# EAGLE design EW Driver (EAGLE 7.5.0)

## Sheet 1 of 2
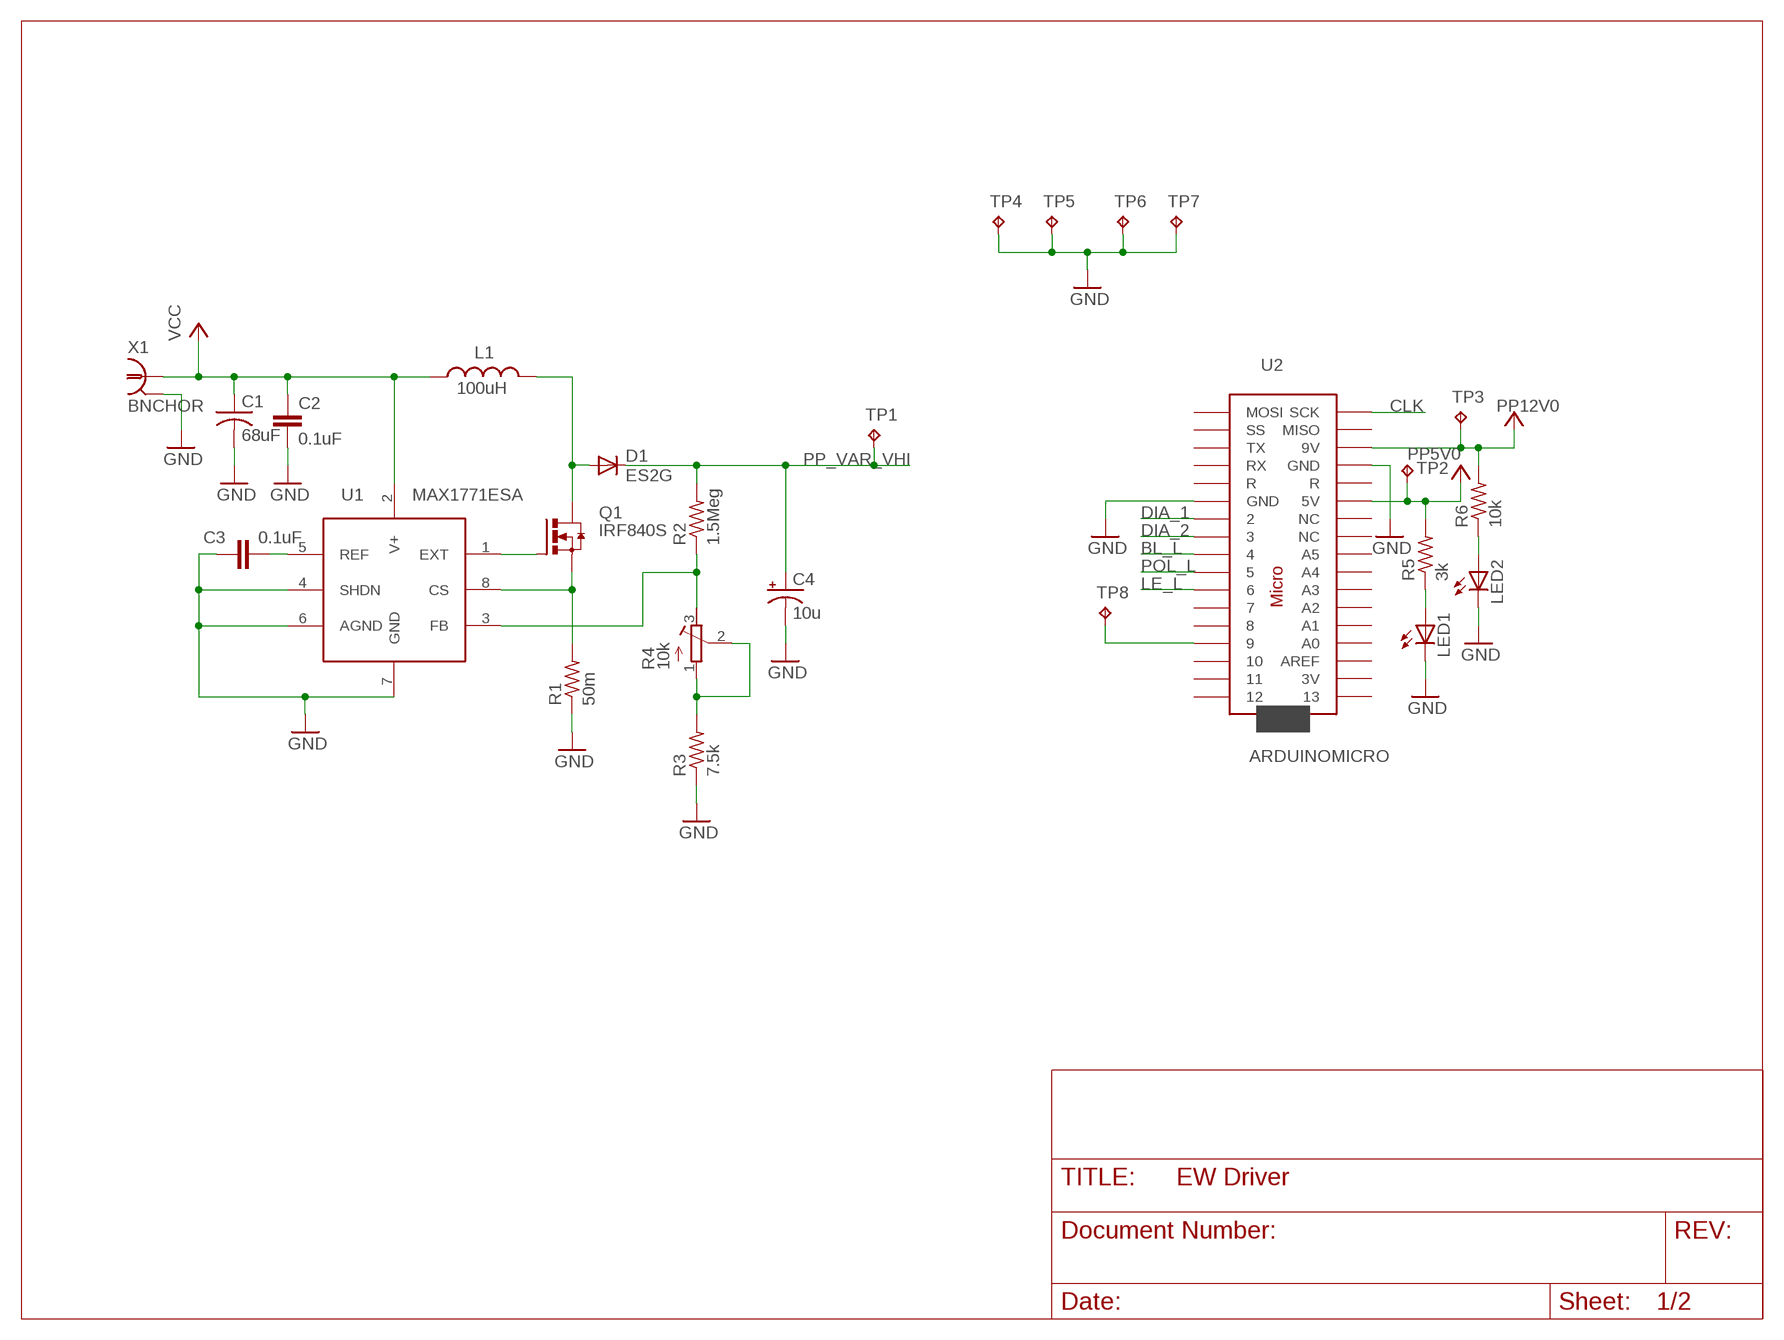
[diagram p0: schematic, sheet 1]

### Parts
C1  68uF  CC2312  [C2312]
C2  0.1uF  CC1206  [C1206]
C3  0.1uF  CC1206  [C1206]
C4  10u  10UF-350V-20%(ELECT)  [PANASONIC_D]
D1  ES2G  DIODE-DO214AA  [DO214AA]
L1  100uH  TDK_IND  [P0762NL]
LED1  LED_ESML0603  [LED_SML0603]
LED2  LED_ESML0603  [LED_SML0603]
Q1  IRF840S  [D2PACK]
R1  50m  R-US_R1206  [R1206]
R2  1.5Meg  R-US_R1206  [R1206]
R3  7.5k  R-US_R0805  [R0805]
R4  10k  R-TRIMM3296P  [RTRIM3296P]
R5  3k  R-US_R0805  [R0805]
R6  10k  R-US_R0805  [R0805]
TP1  TP  [TEST_SMT]
TP2  TP  [TEST_SMT]
TP3  TP  [TEST_SMT]
TP4  TP063  [TEST_TH]
TP5  TP063  [TEST_TH]
TP6  TP063  [TEST_TH]
TP7  TP063  [TEST_TH]
TP8  TP  [TEST_SMT]
U1  MAX1771ESA  [SO08]
U2  ARDUINOMICRO  [ARDUINOMICRO]
X1  BNCHOR  [BNC_HOR]

### Nets
BL_L: U2.P$9 ; also sheet 2
CLK: U2.P$18(SCK) ; also sheet 2
DIA_1: U2.P$11 ; also sheet 2
DIA_2: U2.P$10 ; also sheet 2
GND: C1.2 C2.2 C3.2 C4.- LED1.C LED2.C R1.1 R3.1 TP4.TP TP5.TP TP6.TP TP7.TP U1.4(SHDN) U1.6(AGND) U1.7(GND) U2.P$12(GND) U2.P$21(GND) X1.2 X1.3 ; also sheet 2
LE_L: U2.P$7 ; also sheet 2
N$1: C3.1 U1.5(REF)
N$2: Q1.1(G) U1.1(EXT)
N$3: Q1.3(S) R1.2 U1.8(CS)
N$4: D1.A L1.2 Q1.2(D)
N$5: R3.2 R4.1(A) R4.2(S)
N$6: R2.1 R4.3(E) U1.3(FB)
N$10: LED1.A R5.1
N$11: LED2.A R6.1
N$12: TP8.TP U2.P$4
POL_L: U2.P$8 ; also sheet 2
PP5V0: R5.2 TP2.TP U2.P$23(5V) ; also sheet 2
PP12V0: C1.1 C2.1 L1.1 R6.2 TP3.TP U1.2(V+) U2.P$20(9V) X1.1 ; supply symbol labelled VCC
PP_VAR_VHI: C4.+ D1.C R2.2 TP1.TP ; also sheet 2
Unconnected: U2.P$1 U2.P$2 U2.P$3 U2.P$5 U2.P$6 U2.P$13(R) U2.P$14(RX) U2.P$15(TX) U2.P$16(SS) U2.P$17(MOSI) U2.P$19(MISO) U2.P$22(R) U2.P$24(NC) U2.P$25(NC) U2.P$26(A5) U2.P$27(A4) U2.P$28(A3) U2.P$29(A2) U2.P$30(A1) U2.P$31(A0) U2.P$32(AREF) U2.P$33(3V) U2.P$34

## Sheet 2 of 2
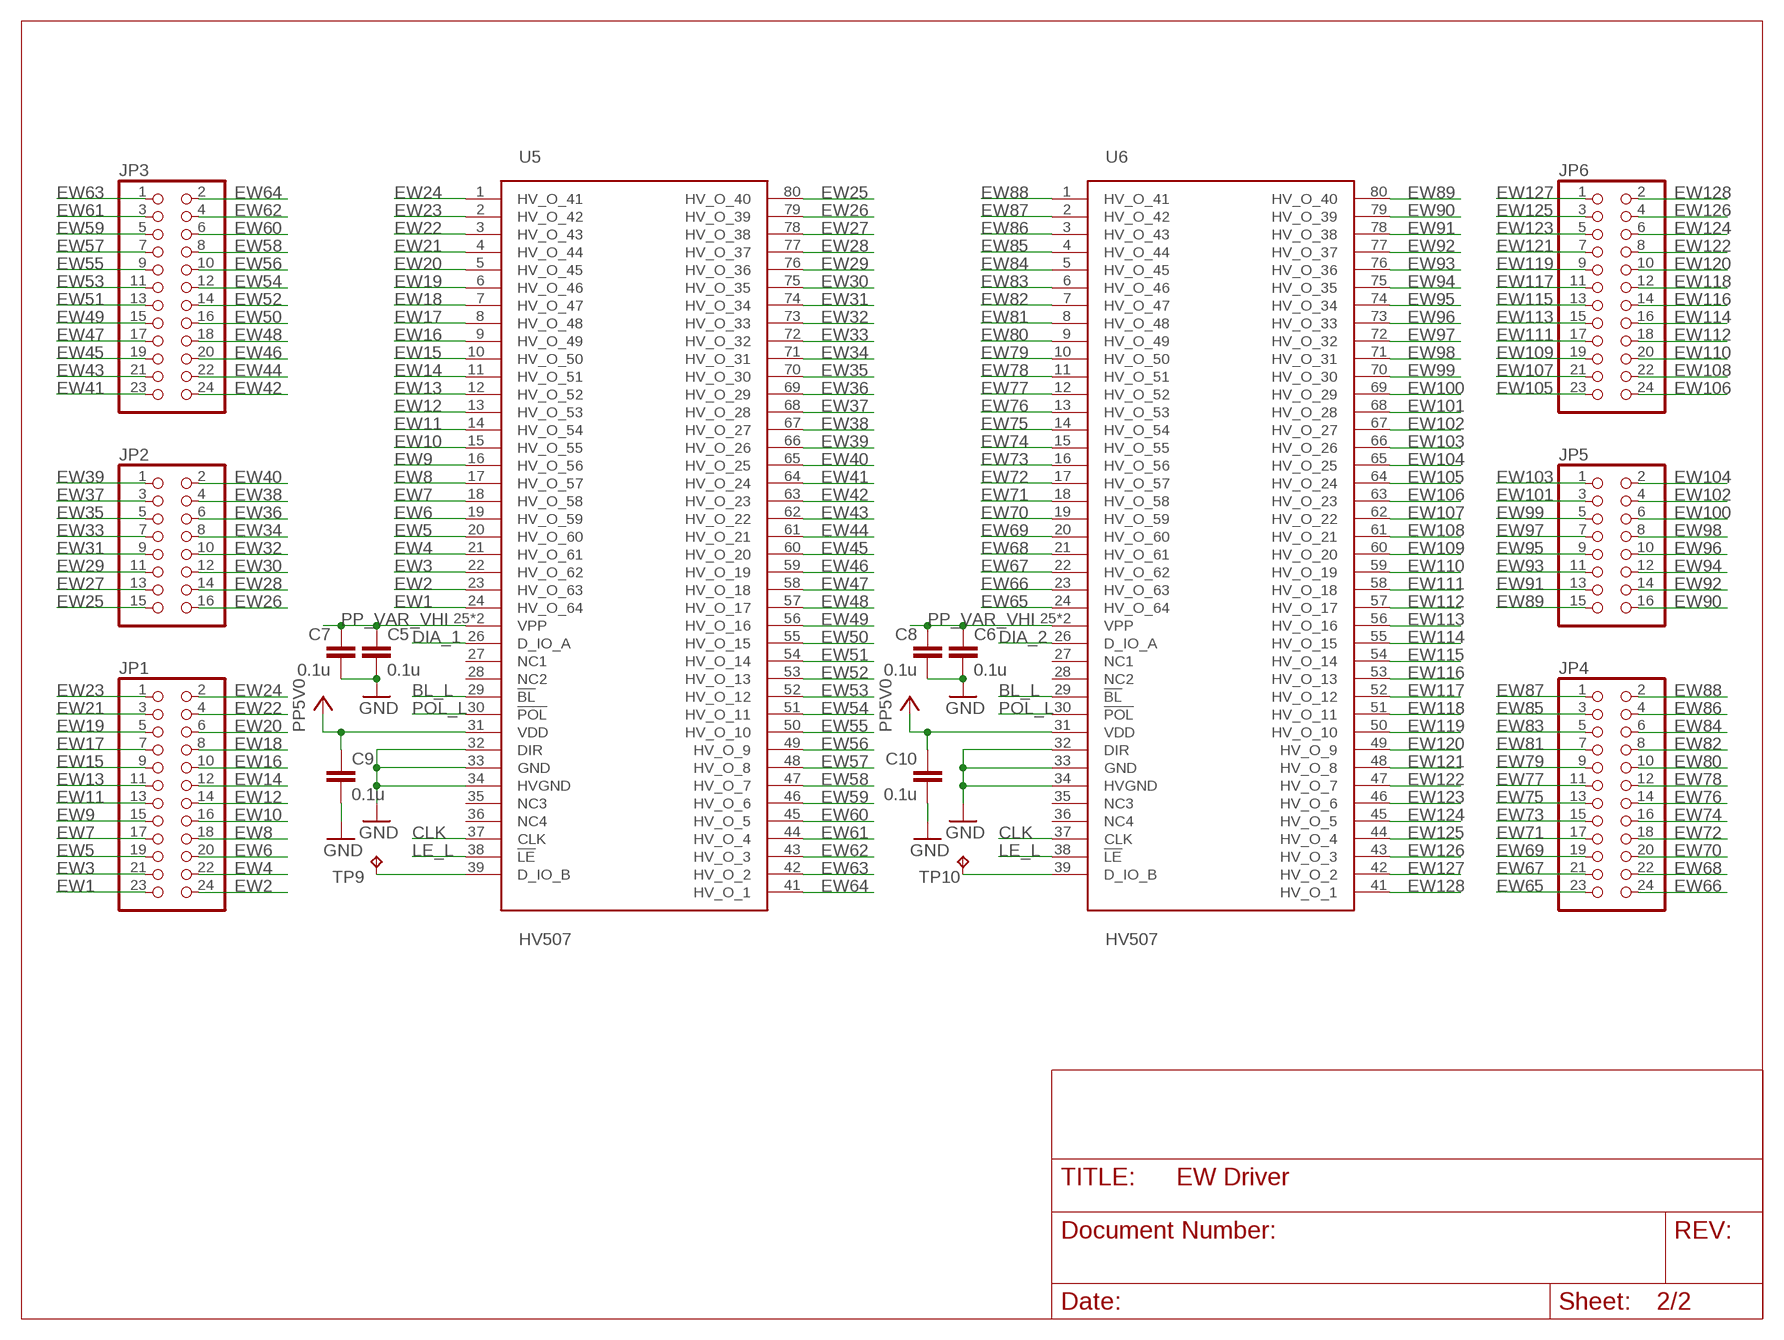
[diagram p1: schematic, sheet 2]

### Parts
C5  0.1u  CC1206  [C1206]
C6  0.1u  CC1206  [C1206]
C7  0.1u  CC1206  [C1206]
C8  0.1u  CC1206  [C1206]
C9  0.1u  CC1206  [C1206]
C10  0.1u  CC1206  [C1206]
JP1  PINHD-2X12_0.05  [2X12_0.05]
JP2  PINHD-2X8_0.05  [2X8_0.05]
JP3  PINHD-2X12_0.05  [2X12_0.05]
JP4  PINHD-2X12_0.05  [2X12_0.05]
JP5  PINHD-2X8_0.05  [2X8_0.05]
JP6  PINHD-2X12_0.05  [2X12_0.05]
TP9  TP  [TEST_SMT]
TP10  TP  [TEST_SMT]
U5  HV507  [HV507PG-G]
U6  HV507  [HV507PG-G]

### Nets
BL_L: U5.29(!BL) U6.29(!BL) ; also sheet 1
CLK: U5.37(CLK) U6.37(CLK) ; also sheet 1
DIA_1: U5.26(D_IO_A) ; also sheet 1
DIA_2: U6.26(D_IO_A) ; also sheet 1
EW1: JP1.23 U5.24(HV_O_64)
EW2: JP1.24 U5.23(HV_O_63)
EW3: JP1.21 U5.22(HV_O_62)
EW4: JP1.22 U5.21(HV_O_61)
EW5: JP1.19 U5.20(HV_O_60)
EW6: JP1.20 U5.19(HV_O_59)
EW7: JP1.17 U5.18(HV_O_58)
EW8: JP1.18 U5.17(HV_O_57)
EW9: JP1.15 U5.16(HV_O_56)
EW10: JP1.16 U5.15(HV_O_55)
EW11: JP1.13 U5.14(HV_O_54)
EW12: JP1.14 U5.13(HV_O_53)
EW13: JP1.11 U5.12(HV_O_52)
EW14: JP1.12 U5.11(HV_O_51)
EW15: JP1.9 U5.10(HV_O_50)
EW16: JP1.10 U5.9(HV_O_49)
EW17: JP1.7 U5.8(HV_O_48)
EW18: JP1.8 U5.7(HV_O_47)
EW19: JP1.5 U5.6(HV_O_46)
EW20: JP1.6 U5.5(HV_O_45)
EW21: JP1.3 U5.4(HV_O_44)
EW22: JP1.4 U5.3(HV_O_43)
EW23: JP1.1 U5.2(HV_O_42)
EW24: JP1.2 U5.1(HV_O_41)
EW25: JP2.15 U5.80(HV_O_40)
EW26: JP2.16 U5.79(HV_O_39)
EW27: JP2.13 U5.78(HV_O_38)
EW28: JP2.14 U5.77(HV_O_37)
EW29: JP2.11 U5.76(HV_O_36)
EW30: JP2.12 U5.75(HV_O_35)
EW31: JP2.9 U5.74(HV_O_34)
EW32: JP2.10 U5.73(HV_O_33)
EW33: JP2.7 U5.72(HV_O_32)
EW34: JP2.8 U5.71(HV_O_31)
EW35: JP2.5 U5.70(HV_O_30)
EW36: JP2.6 U5.69(HV_O_29)
EW37: JP2.3 U5.68(HV_O_28)
EW38: JP2.4 U5.67(HV_O_27)
EW39: JP2.1 U5.66(HV_O_26)
EW40: JP2.2 U5.65(HV_O_25)
EW41: JP3.23 U5.64(HV_O_24)
EW42: JP3.24 U5.63(HV_O_23)
EW43: JP3.21 U5.62(HV_O_22)
EW44: JP3.22 U5.61(HV_O_21)
EW45: JP3.19 U5.60(HV_O_20)
EW46: JP3.20 U5.59(HV_O_19)
EW47: JP3.17 U5.58(HV_O_18)
EW48: JP3.18 U5.57(HV_O_17)
EW49: JP3.15 U5.56(HV_O_16)
EW50: JP3.16 U5.55(HV_O_15)
EW51: JP3.13 U5.54(HV_O_14)
EW52: JP3.14 U5.53(HV_O_13)
EW53: JP3.11 U5.52(HV_O_12)
EW54: JP3.12 U5.51(HV_O_11)
EW55: JP3.9 U5.50(HV_O_10)
EW56: JP3.10 U5.49(HV_O_9)
EW57: JP3.7 U5.48(HV_O_8)
EW58: JP3.8 U5.47(HV_O_7)
EW59: JP3.5 U5.46(HV_O_6)
EW60: JP3.6 U5.45(HV_O_5)
EW61: JP3.3 U5.44(HV_O_4)
EW62: JP3.4 U5.43(HV_O_3)
EW63: JP3.1 U5.42(HV_O_2)
EW64: JP3.2 U5.41(HV_O_1)
EW65: JP4.23 U6.24(HV_O_64)
EW66: JP4.24 U6.23(HV_O_63)
EW67: JP4.21 U6.22(HV_O_62)
EW68: JP4.22 U6.21(HV_O_61)
EW69: JP4.19 U6.20(HV_O_60)
EW70: JP4.20 U6.19(HV_O_59)
EW71: JP4.17 U6.18(HV_O_58)
EW72: JP4.18 U6.17(HV_O_57)
EW73: JP4.15 U6.16(HV_O_56)
EW74: JP4.16 U6.15(HV_O_55)
EW75: JP4.13 U6.14(HV_O_54)
EW76: JP4.14 U6.13(HV_O_53)
EW77: JP4.11 U6.12(HV_O_52)
EW78: JP4.12 U6.11(HV_O_51)
EW79: JP4.9 U6.10(HV_O_50)
EW80: JP4.10 U6.9(HV_O_49)
EW81: JP4.7 U6.8(HV_O_48)
EW82: JP4.8 U6.7(HV_O_47)
EW83: JP4.5 U6.6(HV_O_46)
EW84: JP4.6 U6.5(HV_O_45)
EW85: JP4.3 U6.4(HV_O_44)
EW86: JP4.4 U6.3(HV_O_43)
EW87: JP4.1 U6.2(HV_O_42)
EW88: JP4.2 U6.1(HV_O_41)
EW89: JP5.15 U6.80(HV_O_40)
EW90: JP5.16 U6.79(HV_O_39)
EW91: JP5.13 U6.78(HV_O_38)
EW92: JP5.14 U6.77(HV_O_37)
EW93: JP5.11 U6.76(HV_O_36)
EW94: JP5.12 U6.75(HV_O_35)
EW95: JP5.9 U6.74(HV_O_34)
EW96: JP5.10 U6.73(HV_O_33)
EW97: JP5.7 U6.72(HV_O_32)
EW98: JP5.8 U6.71(HV_O_31)
EW99: JP5.5 U6.70(HV_O_30)
EW100: JP5.6 U6.69(HV_O_29)
EW101: JP5.3 U6.68(HV_O_28)
EW102: JP5.4 U6.67(HV_O_27)
EW103: JP5.1 U6.66(HV_O_26)
EW104: JP5.2 U6.65(HV_O_25)
EW105: JP6.23 U6.64(HV_O_24)
EW106: JP6.24 U6.63(HV_O_23)
EW107: JP6.21 U6.62(HV_O_22)
EW108: JP6.22 U6.61(HV_O_21)
EW109: JP6.19 U6.60(HV_O_20)
EW110: JP6.20 U6.59(HV_O_19)
EW111: JP6.17 U6.58(HV_O_18)
EW112: JP6.18 U6.57(HV_O_17)
EW113: JP6.15 U6.56(HV_O_16)
EW114: JP6.16 U6.55(HV_O_15)
EW115: JP6.13 U6.54(HV_O_14)
EW116: JP6.14 U6.53(HV_O_13)
EW117: JP6.11 U6.52(HV_O_12)
EW118: JP6.12 U6.51(HV_O_11)
EW119: JP6.9 U6.50(HV_O_10)
EW120: JP6.10 U6.49(HV_O_9)
EW121: JP6.7 U6.48(HV_O_8)
EW122: JP6.8 U6.47(HV_O_7)
EW123: JP6.5 U6.46(HV_O_6)
EW124: JP6.6 U6.45(HV_O_5)
EW125: JP6.3 U6.44(HV_O_4)
EW126: JP6.4 U6.43(HV_O_3)
EW127: JP6.1 U6.42(HV_O_2)
EW128: JP6.2 U6.41(HV_O_1)
GND: C5.2 C6.2 C7.2 C8.2 C9.2 C10.2 U5.32(DIR) U5.33(GND) U5.34(HVGND) U6.32(DIR) U6.33(GND) U6.34(HVGND) ; also sheet 1
LE_L: U5.38(!LE) U6.38(!LE) ; also sheet 1
N$13: TP9.TP U5.39(D_IO_B)
N$14: TP10.TP U6.39(D_IO_B)
POL_L: U5.30(!POL) U6.30(!POL) ; also sheet 1
PP5V0: C9.1 C10.1 U5.31(VDD) U6.31(VDD) ; also sheet 1
PP_VAR_VHI: C5.1 C6.1 C7.1 C8.1 U5.25(VPP) U5.40(VPP) U6.25(VPP) U6.40(VPP) ; also sheet 1
Unconnected: U5.27(NC1) U5.28(NC2) U5.35(NC3) U5.36(NC4) U6.27(NC1) U6.28(NC2) U6.35(NC3) U6.36(NC4)

## Library data of the parts
C1 = mimi:CC2312
C2 C3 C5-C10 = eagle-ltspice:C: CAPACITOR, European symbol; SPICEMODEL: NONE; SPICEPREFIX: C
C4 = mimi:10UF-350V-20%(ELECT): Panasonic EB; PROD_ID: CAP-10547
D1 = diode:DIODE-: DIODE
JP1 JP3 JP4 JP6 = mimi:PINHD-2X12_0.05: PIN HEADER
JP2 JP5 = mimi:PINHD-2X8_0.05
L1 = mimi:TDK_IND
LED1 LED2 = mimi:LED_E: LED Source: http://www.osram.convergy.de Source: www.luxeon.com Source: www.kingbright.com; SPICEMODEL: NONE; SPICEPREFIX: D; SPICETYPE: diode
Q1 = mimi:IRF840: SMPS MOSFET HEXFET® Power MOSFET Source: http://www.irf.com/product-info/datasheets/data/irf3704.pdf
R1 R2 R5 R6 = resistor:R-US_: RESISTOR, American symbol
R3 = rcl:R-US_: RESISTOR, American symbol
R4 = rcl:R-TRIMM: Trimm resistor
TP1-TP10 = mimi:TP
U1 = mimi:MAX1771
U2 = mimi:ARDUINOMICRO
U5 U6 = mimi:HV507
X1 = mimi:BNC: BNC CONNECTOR M/A COM www.macom.com distributor Farnell 149-452

## Board
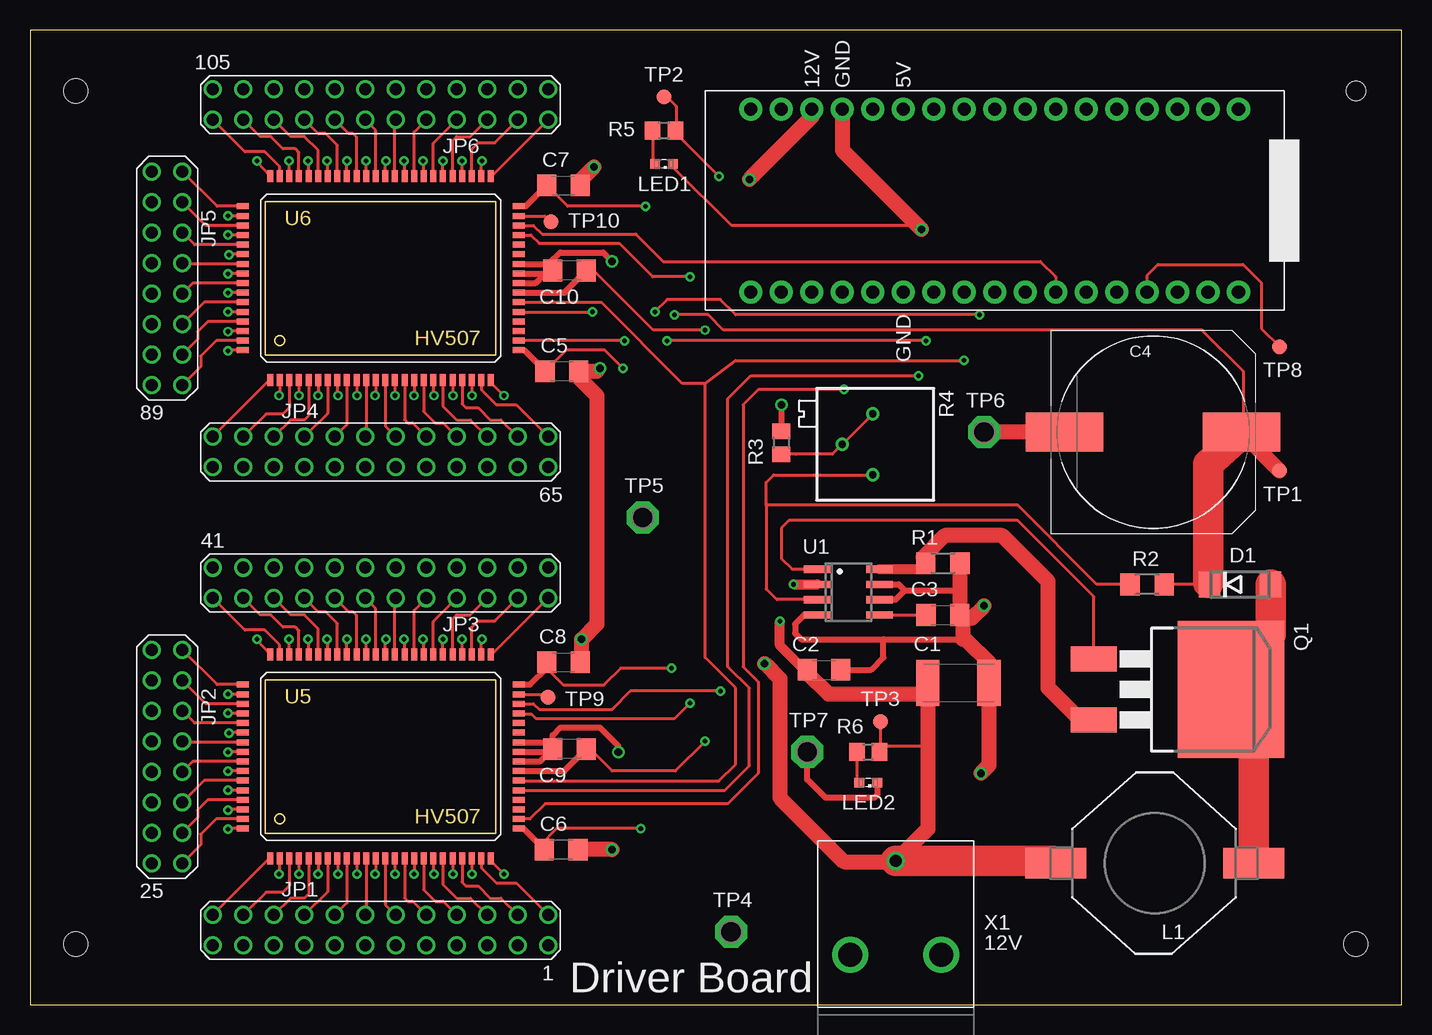
[diagram p2: board, top side]
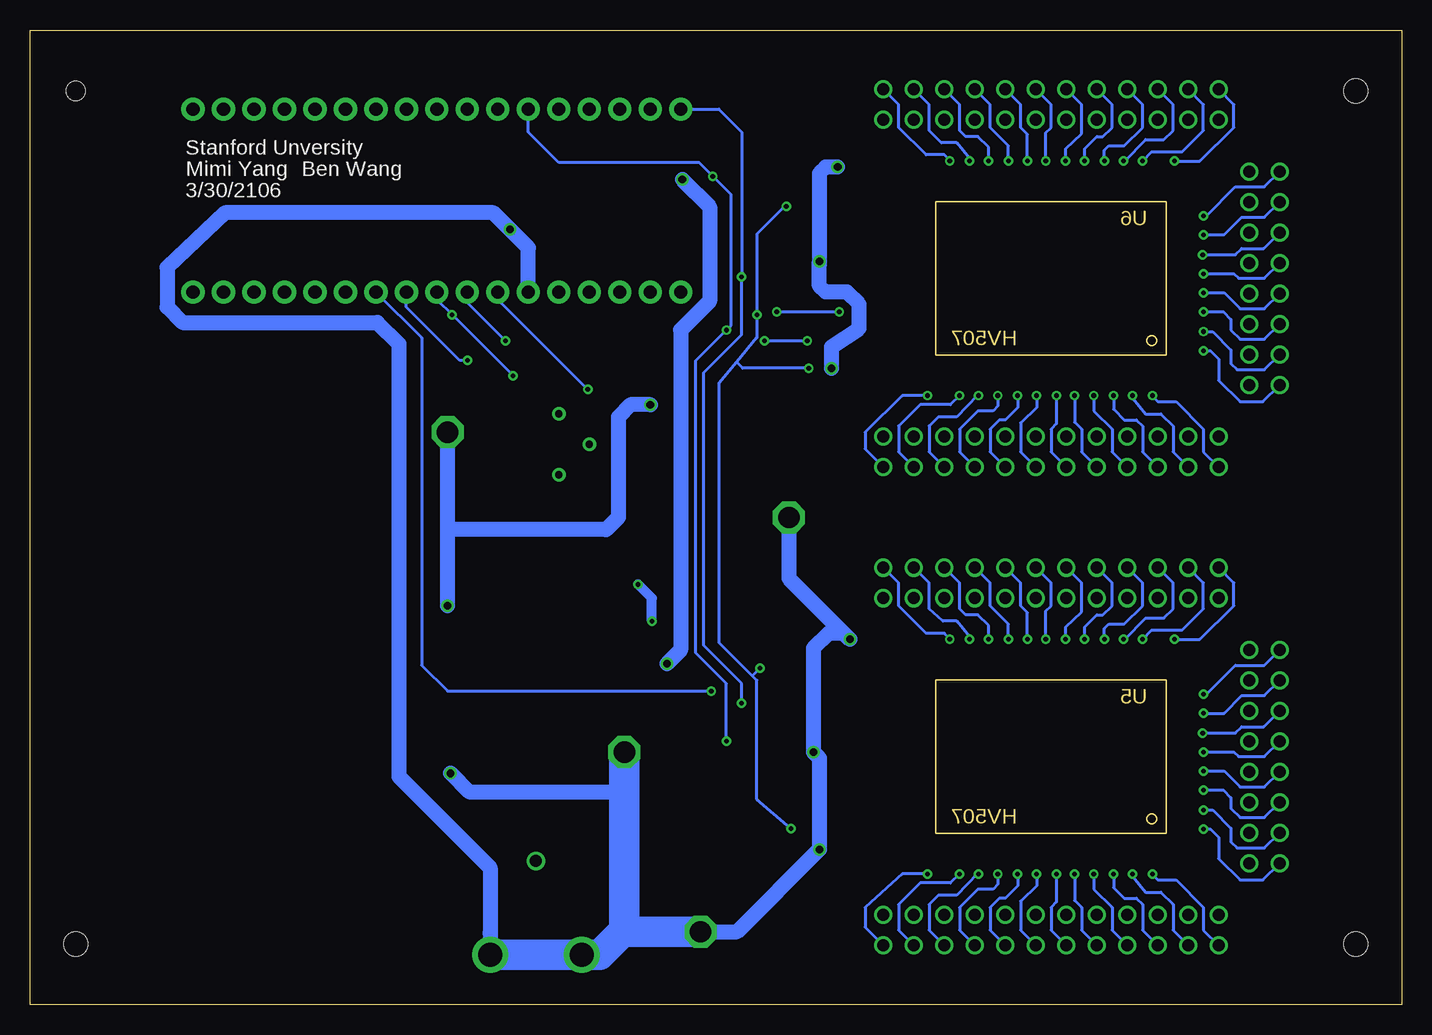
[diagram p3: board, bottom side, seen from below]

Size 114.3 x 81.28 mm. Coordinates in mm from the lower left corner, seen from the top.
Outline: 0,0 114.3,0 114.3,81.28 0,81.28 0,0
Copper layers (1*16): Top 0.035559375mm / dielectric 1.501140625mm / Bottom 0.035559375mm
Design rules "typical_4pcb *": minimum track width 10mil, minimum drill 15mil, track to track 6mil, track to pad 6mil, pad to pad 6mil, via to via 6mil, smd to smd 6mil, copper to edge 15mil, drill to drill 8mil, minimum pad ring 10mil, minimum via ring 8mil, stop-mask expansion 4mil, vias tented up to drill 15mil, thermal gap 10mil
Holes 2 mm at 3.81,5.08 3.81,76.2 110.49,5.08
Holes 1.6 mm at 110.49,76.2

### Footprints (pad centres in the part's own frame; a part is rotated, then mirrored left to right if it is on the bottom)
C2312 = smd 1.93 x 3.81: 1 -0.75,-0.9; 2 4.35,-0.9
C1206 = smd 1.6 x 1.8: 1 -1.4,0; 2 1.4,0
PANASONIC_D = smd 6.452 x 3.251: + 7.35,0; - -7.4,0
DO214AA = smd 1.8 x 2.2: A 2.55,0; C -2.55,0
2X12_0.05 = drill 1 pad 1.372: 1 -13.97,-1.27; 2 -13.97,1.27; 3 -11.43,-1.27; 4 -11.43,1.27; 5 -8.89,-1.27; 6 -8.89,1.27; 7 -6.35,-1.27; 8 -6.35,1.27; 9 -3.81,-1.27; 10 -3.81,1.27; 11 -1.27,-1.27; 12 -1.27,1.27; 13 1.27,-1.27; 14 1.27,1.27; 15 3.81,-1.27; 16 3.81,1.27; 17 6.35,-1.27; 18 6.35,1.27; 19 8.89,-1.27; 20 8.89,1.27; 21 11.43,-1.27; 22 11.43,1.27; 23 13.97,-1.27; 24 13.97,1.27
2X8_0.05 = drill 1 pad 1.372: 1 -8.89,-1.27; 2 -8.89,1.27; 3 -6.35,-1.27; 4 -6.35,1.27; 5 -3.81,-1.27; 6 -3.81,1.27; 7 -1.27,-1.27; 8 -1.27,1.27; 9 1.27,-1.27; 10 1.27,1.27; 11 3.81,-1.27; 12 3.81,1.27; 13 6.35,-1.27; 14 6.35,1.27; 15 8.89,-1.27; 16 8.89,1.27
P0762NL = smd 2.54 x 5.08: 1 0,8.256; 2 0,-8.256
LED_SML0603 = smd 0.8 x 0.8: A 0.75,0; C -0.75,0
D2PACK = smd 2.083 x 3.81: 1 -2.54,-8.89; 3 2.54,-8.89 | smd 11.43 x 8.89: 2 0,2.54
R1206 = smd 1.6 x 1.803: 1 -1.422,0; 2 1.422,0
R0805 = smd 1.3 x 1.5: 1 -0.95,0; 2 0.95,0
RTRIM3296P = drill 0.61: 1 0,-2.54; 2 2.54,0; 3 0,2.54
TEST_SMT = smd 1.27 x 1.27: TP 0,0
TEST_TH = drill 1.778 octagon: TP 0,0
SO08 = smd 0.6 x 2.2: 1 -1.905,-2.6; 2 -0.635,-2.6; 3 0.635,-2.6; 4 1.905,-2.6; 5 1.905,2.6; 6 0.635,2.6; 7 -0.635,2.6; 8 -1.905,2.6
ARDUINOMICRO = drill 1.1 pad 1.93: P$1 -20.32,7.62; P$2 -17.78,7.62; P$3 -15.24,7.62; P$4 -12.7,7.62; P$5 -10.16,7.62; P$6 -7.62,7.62; P$7 -5.08,7.62; P$8 -2.54,7.62; P$9 0,7.62; P$10 2.54,7.62; P$11 5.08,7.62; P$12 12.7,-7.62; P$13 10.16,-7.62; P$14 12.7,7.62; P$15 15.24,7.62; P$16 17.78,7.62; P$17 20.32,7.62; P$18 20.32,-7.62; P$19 17.78,-7.62; P$20 15.24,-7.62; P$21 7.62,7.62; P$22 10.16,7.62; P$23 7.62,-7.62; P$24 5.08,-7.62; P$25 2.54,-7.62; P$26 0,-7.62; P$27 -2.54,-7.62; P$28 -5.08,-7.62; P$29 -7.62,-7.62; P$30 -10.16,-7.62; P$31 -12.7,-7.62; P$32 -15.24,-7.62; P$33 -17.78,-7.62; P$34 -20.32,-7.62
HV507PG-G = smd 0.5 x 1: 1 -9.2,-8.5; 2 -8.4,-8.5; 3 -7.6,-8.5; 4 -6.8,-8.5; 5 -6,-8.5; 6 -5.2,-8.5; 7 -4.4,-8.5; 8 -3.6,-8.5; 9 -2.8,-8.5; 10 -2,-8.5; 11 -1.2,-8.5; 12 -0.4,-8.5; 13 0.4,-8.5; 14 1.2,-8.5; 15 2,-8.5; 16 2.8,-8.5; 17 3.6,-8.5; 18 4.4,-8.5; 19 5.2,-8.5; 20 6,-8.5; 21 6.8,-8.5; 22 7.6,-8.5; 23 8.4,-8.5; 24 9.2,-8.5; 41 9.2,8.5; 42 8.4,8.5; 43 7.6,8.5; 44 6.8,8.5; 45 6,8.5; 46 5.2,8.5; 47 4.4,8.5; 48 3.6,8.5; 49 2.8,8.5; 50 2,8.5; 51 1.2,8.5; 52 0.4,8.5; 53 -0.4,8.5; 54 -1.2,8.5; 55 -2,8.5; 56 -2.8,8.5; 57 -3.6,8.5; 58 -4.4,8.5; 59 -5.2,8.5; 60 -6,8.5; 61 -6.8,8.5; 62 -7.6,8.5; 63 -8.4,8.5; 64 -9.2,8.5 | smd 1 x 0.5: 25 11.5,-6; 26 11.5,-5.2; 27 11.5,-4.4; 28 11.5,-3.6; 29 11.5,-2.8; 30 11.5,-2; 31 11.5,-1.2; 32 11.5,-0.4; 33 11.5,0.4; 34 11.5,1.2; 35 11.5,2; 36 11.5,2.8; 37 11.5,3.6; 38 11.5,4.4; 39 11.5,5.2; 40 11.5,6; 65 -11.5,6; 66 -11.5,5.2; 67 -11.5,4.4; 68 -11.5,3.6; 69 -11.5,2.8; 70 -11.5,2; 71 -11.5,1.2; 72 -11.5,0.4; 73 -11.5,-0.4; 74 -11.5,-1.2; 75 -11.5,-2; 76 -11.5,-2.8; 77 -11.5,-3.6; 78 -11.5,-4.4; 79 -11.5,-5.2; 80 -11.5,-6
BNC_HOR = drill 1: 1 0,7.8 | drill 2: 2 3.8,0; 3 -3.8,0

### Placement (x,y rotation side)
C1  75.56,27.75 0 top
C2  66.17,27.94 0 top
C3  76.07,32.51 0 top
C4  93.6,47.75 0 top
C5  44.32,52.83 0 top
C6  44.26,12.95 0 top
C7  44.45,68.33 0 top
C8  44.45,28.57 0 top
C9  44.96,21.34 180 top
C10  44.96,61.21 180 top
D1  100.84,35.05 0 top
JP1  29.21,6.22 0 top
JP2  11.43,20.7 270 top
JP3  29.21,35.18 180 top
JP4  29.21,46.1 0 top
JP5  11.43,60.58 270 top
JP6  29.21,75.06 180 top
L1  93.73,11.81 90 top
LED1  52.83,70.1 180 top
LED2  69.85,18.54 180 top
Q1  97.54,26.29 270 top
R1  76.07,36.83 180 top
R2  93.09,35.05 0 top
R3  62.61,46.86 270 top
R4  70.23,46.74 180 top
R5  52.83,72.9 0 top
R6  69.85,21.08 0 top
TP1  104.14,44.51 0 top
TP2  52.83,75.69 0 top
TP3  70.87,23.62 0 top
TP4  58.42,6.1 0 top
TP5  51.05,40.64 0 top
TP6  79.5,47.75 0 top
TP7  64.77,21.08 0 top
TP8  104.14,54.86 0 top
TP9  43.18,25.65 0 top
TP10  43.43,65.28 0 top
U1  68.2,34.42 270 top
U2  80.39,67.06 180 top
U5  29.21,20.7 0 top
U6  29.21,60.58 0 top
X1  72.14,4.19 0 top

### Tracks (layer width: path | path; a pad name or v marks a point on that pad's centre or on a via)
BL_L  (via drill 0.38, 0.38 pad 0.64)
  Top 0.254: v79.12,57.53 58.8,57.53 57.53,58.8 53.09,58.8 v52.07,57.78 | U5.29 57.91,17.9 59.94,19.94 59.94,26.42 58.17,28.19 58.17,50.55 60.07,52.45 v74.04,52.45 | U6.29 v46.86,57.78
  Bottom 0.254: U2.P$9 80.39,58.8 v79.12,57.53 v74.04,52.45 | v52.07,57.78 v46.86,57.78
CLK  (via drill 0.38)
  Top 0.254: v54.99,60.71 51.88,60.71 49.09,63.5 42.42,63.5 41.74,64.18 U6.37 | 40.67,24.26 U5.37 40.75,24.26 41.78,24.26 42.16,23.88 53.72,23.88 v54.99,25.15
  Bottom 0.254: U2.P$18 56.9,74.68 54.99,72.77 v54.99,60.71 54.99,55.88 58.17,52.7 58.17,29.97 54.99,26.8 v54.99,25.15
DIA_1  (via drill 0.38)
  Top 0.254: v67.82,51.31 60.71,51.31 59.44,50.04 59.44,28.19 60.71,26.92 60.71,19.3 58.17,16.76 42.93,16.76 41.66,15.49 U5.26
  Bottom 0.254: U2.P$11 75.31,58.8 v67.82,51.31
DIA_2  (via drill 0.38)
  Top 0.254: v74.68,55.37 v53.09,55.37 | v49.53,55.37 U6.26
  Bottom 0.254: U2.P$10 77.85,58.55 v74.68,55.37 | v53.09,55.37 v49.53,55.37
EW1  (via drill 0.38)
  Top 0.254: 39.43,11.06 v39.5,10.92 38.41,12.01 U5.24
  Bottom 0.254: v39.5,10.92 41.59,10.92 44.7,8.13 44.7,6.48 JP1.23
EW2
  Top 0.254: JP1.24 40.51,10.16 38.86,10.16 37.61,11.41 U5.23
EW3  (via drill 0.38)
  Top 0.254: U5.22 36.81,10.94 v36.83,10.92
  Bottom 0.254: v36.83,10.92 37.59,10.16 40.13,10.16 41.91,8.38 41.91,6.22 JP1.21
EW4
  Top 0.254: JP1.22 39.24,8.89 38.35,8.89 37.34,9.91 36.32,9.91 36.01,10.22 U5.21
EW5  (via drill 0.38)
  Top 0.254: 35.21,10.89 v35.24,10.92 35.21,10.95 U5.20
  Bottom 0.254: v35.24,10.92 35.37,10.92 37.08,9.14 38.61,9.14 39.37,8.38 39.37,6.22 JP1.19
EW6
  Top 0.254: JP1.20 36.7,8.89 35.56,8.89 34.41,10.04 U5.19
EW7  (via drill 0.38)
  Top 0.254: U5.18 33.61,10.97 v33.66,10.92
  Bottom 0.254: v33.66,10.92 33.66,10.03 34.04,9.65 35.31,9.65 36.83,8.13 36.83,6.22 JP1.17
EW8
  Top 0.254: JP1.18 34.42,8.64 33.78,8.64 32.81,9.61 U5.17
EW9  (via drill 0.38)
  Top 0.254: 32.01,11.18 v32,10.92 U5.16
  Bottom 0.254: v32,10.92 32,9.91 33.02,8.89 33.53,8.89 34.29,8.13 34.29,6.22 JP1.15
EW10
  Top 0.254: JP1.16 31.88,8.64 31.5,8.64 31.21,8.92 U5.15
EW11  (via drill 0.38)
  Top 0.254: 30.41,10.99 v30.42,10.92 U5.14
  Bottom 0.254: v30.42,10.92 30.42,9.91 31.75,8.64 31.75,6.22 JP1.13
EW12
  Top 0.254: JP1.14 29.61,8.36 U5.13
EW13  (via drill 0.38)
  Top 0.254: 28.81,10.65 v28.77,10.92 28.81,10.97 U5.12
  Bottom 0.254: v28.77,10.92 28.77,8.57 29.21,8.13 29.21,6.22 JP1.11
EW14
  Top 0.254: U5.11 28.01,7.56 JP1.12
EW15  (via drill 0.38)
  Top 0.254: 27.21,10.89 v27.24,10.92 27.24,12.2 U5.10
  Bottom 0.254: v27.24,10.92 27.24,8.7 26.67,8.13 26.67,6.22 JP1.9
EW16
  Top 0.254: JP1.10 26.41,8.5 U5.9
EW17  (via drill 0.38)
  Top 0.254: 25.61,10.97 v25.65,10.92 25.65,12.2 U5.8
  Bottom 0.254: v25.65,10.92 25.65,9.65 24.13,8.13 24.13,6.22 JP1.7
EW18
  Top 0.254: JP1.8 24.81,9.44 U5.7
EW19  (via drill 0.38)
  Top 0.254: 24.01,10.87 v24,10.92 U5.6
  Bottom 0.254: v24,10.92 24,9.78 23.11,8.89 22.1,8.89 21.59,8.38 21.59,6.22 JP1.5
EW20
  Top 0.254: JP1.6 21.72,8.89 22.86,8.89 23.21,9.24 U5.5
EW21  (via drill 0.38)
  Top 0.254: v22.41,10.93 v22.42,10.92 U5.4
  Bottom 0.254: v22.42,10.92 22.42,10.73 21.34,9.4 20.07,9.4 19.05,8.38 19.05,6.22 JP1.3
EW22
  Top 0.254: JP1.4 19.69,9.4 21.08,9.4 21.61,9.93 U5.3
EW23  (via drill 0.38)
  Top 0.254: v20.77,10.92 20.81,11.03 U5.2
  Bottom 0.254: v20.77,10.92 20.77,10.86 20.32,10.41 18.8,10.41 16.51,8.13 16.51,6.22 JP1.1
EW24
  Top 0.254: U5.1 19.95,12.2 JP1.2
EW25  (via drill 0.38)
  Top 0.254: U5.80 16.61,14.7 v16.51,14.67
  Bottom 0.254: v16.51,14.67 15.94,14.67 15.24,13.97 15.24,12.19 13.46,10.41 11.56,10.41 JP2.15
EW26
  Top 0.254: U5.79 15.5,15.5 14.22,14.22 14.22,13.34 JP2.16
EW27  (via drill 0.38)
  Top 0.254: U5.78 16.55,16.3 v16.51,16.26
  Bottom 0.254: v16.51,16.26 15.75,16.26 14.22,14.73 14.22,13.59 13.72,13.08 11.43,13.08 JP2.13
EW28
  Top 0.254: U5.77 14.81,17.1 13.97,16.26 13.97,15.62 JP2.14
EW29  (via drill 0.38)
  Top 0.254: U5.76 16.58,17.9 v16.51,17.91
  Bottom 0.254: v16.51,17.91 14.86,17.91 14.22,17.27 14.22,16.38 13.46,15.62 11.43,15.62 JP2.11
EW30
  Top 0.254: U5.75 14.51,18.7 JP2.12
EW31  (via drill 0.38)
  Top 0.254: U5.74 16.58,19.5 v16.51,19.49
  Bottom 0.254: v16.51,19.49 14.79,19.49 13.46,18.16 11.43,18.16 JP2.9
EW32
  Top 0.254: U5.73 13.57,20.3 JP2.10
EW33  (via drill 0.38)
  Top 0.254: U5.72 16.53,21.1 v16.51,21.08
  Bottom 0.254: v16.51,21.08 13.97,21.08 13.59,20.7 11.43,20.7 JP2.7
EW34
  Top 0.254: U5.71 12.77,21.9 JP2.8
EW35  (via drill 0.38)
  Top 0.254: U5.70 16.61,22.7 v16.57,22.67
  Bottom 0.254: v16.57,22.67 13.84,22.67 13.34,23.18 11.49,23.18 JP2.5
EW36
  Top 0.254: U5.69 13.71,23.5 JP2.6
EW37  (via drill 0.38)
  Top 0.254: U5.68 16.59,24.3 v16.51,24.32
  Bottom 0.254: v16.51,24.32 14.79,24.32 13.34,25.78 11.43,25.78 JP2.3
EW38
  Top 0.254: U5.67 14.65,25.1 JP2.4
EW39  (via drill 0.38)
  Top 0.254: U5.66 16.58,25.9 v16.51,25.91
  Bottom 0.254: v16.51,25.91 16.26,25.91 13.84,28.32 11.43,28.32 JP2.1
EW40
  Top 0.254: U5.65 15.59,26.7 JP2.2
EW41  (via drill 0.38)
  Top 0.254: U5.64 18.99,30.35 v18.92,30.48
  Bottom 0.254: v18.92,30.48 16.83,30.48 13.97,33.27 13.97,35.18 JP3.23
EW42
  Top 0.254: U5.63 20.81,29.99 19.56,31.24 17.91,31.24 JP3.24
EW43  (via drill 0.38)
  Top 0.254: U5.62 21.61,30.46 v21.59,30.48
  Bottom 0.254: v21.59,30.48 20.83,31.24 18.29,31.24 16.51,33.02 16.51,35.18 JP3.21
EW44
  Top 0.254: U5.61 22.41,31.18 22.1,31.5 21.08,31.5 20.07,32.51 19.18,32.51 JP3.22
EW45  (via drill 0.38)
  Top 0.254: U5.60 23.21,30.51 v23.18,30.48
  Bottom 0.254: v23.18,30.48 23.05,30.48 21.34,32.26 19.81,32.26 19.05,33.02 19.05,35.18 JP3.19
EW46
  Top 0.254: U5.59 24.01,31.36 22.86,32.51 21.72,32.51 JP3.20
EW47  (via drill 0.38)
  Top 0.254: U5.58 24.81,30.43 v24.77,30.48
  Bottom 0.254: v24.77,30.48 24.77,31.37 24.38,31.75 23.11,31.75 21.59,33.27 21.59,35.18 JP3.17
EW48
  Top 0.254: U5.57 25.61,31.79 24.64,32.77 24,32.77 JP3.18
EW49  (via drill 0.38)
  Top 0.254: U5.56 26.41,30.22 v26.42,30.48
  Bottom 0.254: v26.42,30.48 26.42,31.5 25.4,32.51 24.89,32.51 24.13,33.27 24.13,35.18 JP3.15
EW50
  Top 0.254: U5.55 27.21,32.48 26.92,32.77 26.54,32.77 JP3.16
EW51  (via drill 0.38)
  Top 0.254: U5.54 28.01,30.41 v28,30.48
  Bottom 0.254: v28,30.48 28,31.5 26.67,32.77 26.67,35.18 JP3.13
EW52
  Top 0.254: U5.53 28.81,33.04 JP3.14
EW53  (via drill 0.38)
  Top 0.254: U5.52 29.61,30.75 v29.66,30.48
  Bottom 0.254: v29.66,30.48 29.66,32.83 29.21,33.27 29.21,35.18 JP3.11
EW54
  Top 0.254: U5.51 30.41,33.84 JP3.12
EW55  (via drill 0.38)
  Top 0.254: U5.50 31.21,30.51 v31.18,30.48
  Bottom 0.254: v31.18,30.48 31.18,32.7 31.75,33.27 31.75,35.18 JP3.9
EW56
  Top 0.254: U5.49 32.01,32.9 JP3.10
EW57  (via drill 0.38)
  Top 0.254: U5.48 32.81,30.44 v32.77,30.48
  Bottom 0.254: v32.77,30.48 32.77,31.75 34.29,33.27 34.29,35.18 JP3.7
EW58
  Top 0.254: U5.47 33.61,31.96 JP3.8
EW59  (via drill 0.38)
  Top 0.254: U5.46 34.41,30.54 v34.42,30.48
  Bottom 0.254: v34.42,30.48 34.42,31.62 35.31,32.51 36.32,32.51 36.83,33.02 36.83,35.18 JP3.5
EW60
  Top 0.254: U5.45 35.21,32.16 35.56,32.51 36.7,32.51 JP3.6
EW61  (via drill 0.38)
  Top 0.254: U5.44 v36.01,30.47 v36,30.48
  Bottom 0.254: v36,30.48 36,30.67 37.08,32 38.23,32 39.37,33.02 39.37,35.18 JP3.3
EW62
  Top 0.254: U5.43 36.81,31.48 37.34,32 38.73,32 JP3.4
EW63  (via drill 0.38)
  Top 0.254: U5.42 37.61,30.37 v37.66,30.48
  Bottom 0.254: v37.66,30.48 37.66,30.54 38.1,30.99 39.62,30.99 41.91,33.27 41.91,35.18 JP3.1
EW64
  Top 0.254: JP3.2 38.47,29.2 U5.41
EW65  (via drill 0.38)
  Top 0.254: 39.43,50.93 v39.5,50.8 38.41,51.89 U6.24
  Bottom 0.254: v39.5,50.8 41.59,50.8 44.7,47.75 44.7,46.35 JP4.23
EW66
  Top 0.254: JP4.24 40.51,50.04 38.86,50.04 37.61,51.29 U6.23
EW67  (via drill 0.38)
  Top 0.254: U6.22 36.81,50.82 v36.83,50.8
  Bottom 0.254: v36.83,50.8 37.59,50.04 40.13,50.04 41.91,48.26 41.91,46.1 JP4.21
EW68
  Top 0.254: JP4.22 39.24,48.77 38.35,48.77 37.34,49.78 36.32,49.78 36.01,50.1 U6.21
EW69  (via drill 0.38)
  Top 0.254: 35.21,50.77 v35.24,50.8 35.21,50.83 U6.20
  Bottom 0.254: v35.24,50.8 35.37,50.8 37.08,49.02 38.61,49.02 39.37,48.26 39.37,46.1 JP4.19
EW70
  Top 0.254: JP4.20 36.7,48.77 35.56,48.77 34.41,49.92 U6.19
EW71  (via drill 0.38)
  Top 0.254: U6.18 33.61,50.84 v33.66,50.8
  Bottom 0.254: v33.66,50.8 33.66,49.91 34.04,49.53 35.31,49.53 36.83,48.01 36.83,46.1 JP4.17
EW72
  Top 0.254: JP4.18 34.42,48.51 33.78,48.51 32.81,49.49 U6.17
EW73  (via drill 0.38)
  Top 0.254: 32.01,51.06 v32,50.8 v32.01,50.81 U6.16
  Bottom 0.254: v32,50.8 32,49.78 33.02,48.77 33.53,48.77 34.29,48.01 34.29,46.1 JP4.15
EW74
  Top 0.254: JP4.16 31.88,48.51 31.5,48.51 31.21,48.8 U6.15
EW75  (via drill 0.38)
  Top 0.254: 30.41,50.87 v30.42,50.8 v30.41,50.81 U6.14
  Bottom 0.254: v30.42,50.8 30.42,49.78 31.75,48.51 31.75,46.1 JP4.13
EW76
  Top 0.254: JP4.14 29.61,48.24 U6.13
EW77  (via drill 0.38)
  Top 0.254: 28.81,50.53 v28.77,50.8 28.81,50.84 U6.12
  Bottom 0.254: v28.77,50.8 28.77,48.45 29.21,48.01 29.21,46.1 JP4.11
EW78
  Top 0.254: U6.11 28.01,47.44 JP4.12
EW79  (via drill 0.38)
  Top 0.254: 27.21,50.77 v27.24,50.8 27.21,50.83 U6.10
  Bottom 0.254: v27.24,50.8 27.24,48.58 26.67,48.01 26.67,46.1 JP4.9
EW80
  Top 0.254: JP4.10 26.41,48.38 U6.9
EW81  (via drill 0.38)
  Top 0.254: U6.8 25.61,50.84 v25.65,50.8
  Bottom 0.254: v25.65,50.8 25.65,49.53 24.13,48.01 24.13,46.1 JP4.7
EW82
  Top 0.254: JP4.8 24.81,49.32 U6.7
EW83  (via drill 0.38)
  Top 0.254: 24.01,50.74 v24,50.8 v24.01,50.81 U6.6
  Bottom 0.254: v24,50.8 24,49.66 23.11,48.77 22.1,48.77 21.59,48.26 21.59,46.1 JP4.5
EW84
  Top 0.254: JP4.6 21.72,48.77 22.86,48.77 23.21,49.12 U6.5
EW85  (via drill 0.38)
  Top 0.254: U6.4 v22.41,50.81 v22.42,50.8
  Bottom 0.254: v22.42,50.8 22.42,50.61 21.34,49.28 20.07,49.28 19.05,48.26 19.05,46.1 JP4.3
EW86
  Top 0.254: JP4.4 19.69,49.28 21.08,49.28 21.61,49.8 U6.3
EW87  (via drill 0.38)
  Top 0.254: 20.81,50.91 v20.77,50.8 20.81,50.85 U6.2
  Bottom 0.254: v20.77,50.8 20.77,50.74 20.32,50.29 18.8,50.29 16.51,48.01 16.51,46.1 JP4.1
EW88
  Top 0.254: U6.1 19.95,52.08 JP4.2
EW89  (via drill 0.38)
  Top 0.254: U6.80 16.61,54.58 v16.51,54.55
  Bottom 0.254: v16.51,54.55 15.94,54.55 15.24,53.85 15.24,52.07 13.46,50.29 11.56,50.29 JP5.15
EW90
  Top 0.254: U6.79 15.5,55.38 14.22,54.1 14.22,53.21 JP5.16
EW91  (via drill 0.38)
  Top 0.254: U6.78 16.55,56.18 v16.51,56.13
  Bottom 0.254: v16.51,56.13 15.75,56.13 14.22,54.61 14.22,53.47 13.72,52.96 11.43,52.96 JP5.13
EW92
  Top 0.254: U6.77 14.81,56.98 13.97,56.13 13.97,55.5 JP5.14
EW93  (via drill 0.38)
  Top 0.254: U6.76 16.58,57.78 v16.51,57.78
  Bottom 0.254: v16.51,57.78 14.86,57.78 14.22,57.15 14.22,56.26 13.46,55.5 11.43,55.5 JP5.11
EW94
  Top 0.254: U6.75 14.51,58.58 JP5.12
EW95  (via drill 0.38)
  Top 0.254: U6.74 16.58,59.38 v16.51,59.37
  Bottom 0.254: v16.51,59.37 14.79,59.37 13.46,58.04 11.43,58.04 JP5.9
EW96
  Top 0.254: U6.73 13.57,60.18 JP5.10
EW97  (via drill 0.38)
  Top 0.254: U6.72 16.53,60.98 v16.51,60.96
  Bottom 0.254: v16.51,60.96 13.97,60.96 13.59,60.58 11.43,60.58 JP5.7
EW98
  Top 0.254: U6.71 12.77,61.78 JP5.8
EW99  (via drill 0.38)
  Top 0.254: U6.70 16.61,62.58 v16.57,62.55
  Bottom 0.254: v16.57,62.55 13.84,62.55 13.34,63.06 11.49,63.06 JP5.5
EW100
  Top 0.254: U6.69 13.71,63.38 JP5.6
EW101  (via drill 0.38)
  Top 0.254: U6.68 16.59,64.18 v16.51,64.2
  Bottom 0.254: v16.51,64.2 14.79,64.2 13.34,65.66 11.43,65.66 JP5.3
EW102
  Top 0.254: U6.67 14.65,64.98 JP5.4
EW103  (via drill 0.38)
  Top 0.254: U6.66 16.58,65.78 v16.51,65.79
  Bottom 0.254: v16.51,65.79 16.26,65.79 13.84,68.2 11.43,68.2 JP5.1
EW104
  Top 0.254: U6.65 15.59,66.58 JP5.2
EW105  (via drill 0.38)
  Top 0.254: U6.64 18.99,70.22 v18.92,70.36
  Bottom 0.254: v18.92,70.36 16.83,70.36 13.97,73.15 13.97,75.06 JP6.23
EW106
  Top 0.254: U6.63 20.81,69.87 19.56,71.12 17.91,71.12 JP6.24
EW107  (via drill 0.38)
  Top 0.254: U6.62 21.61,70.34 v21.59,70.36
  Bottom 0.254: v21.59,70.36 20.83,71.12 18.29,71.12 16.51,72.9 16.51,75.06 JP6.21
EW108
  Top 0.254: U6.61 22.41,71.06 22.1,71.37 21.08,71.37 20.07,72.39 19.18,72.39 JP6.22
EW109  (via drill 0.38)
  Top 0.254: U6.60 23.21,70.39 v23.18,70.36
  Bottom 0.254: v23.18,70.36 23.05,70.36 21.34,72.14 19.81,72.14 19.05,72.9 19.05,75.06 JP6.19
EW110
  Top 0.254: U6.59 24.01,71.24 22.86,72.39 21.72,72.39 JP6.20
EW111  (via drill 0.38)
  Top 0.254: U6.58 24.81,70.31 v24.77,70.36
  Bottom 0.254: v24.77,70.36 24.77,71.25 24.38,71.63 23.11,71.63 21.59,73.15 21.59,75.06 JP6.17
EW112
  Top 0.254: U6.57 25.61,71.67 24.64,72.64 24,72.64 JP6.18
EW113  (via drill 0.38)
  Top 0.254: U6.56 26.41,70.1 v26.42,70.36
  Bottom 0.254: v26.42,70.36 26.42,71.37 25.4,72.39 24.89,72.39 24.13,73.15 24.13,75.06 JP6.15
EW114
  Top 0.254: U6.55 27.21,72.36 26.92,72.64 26.54,72.64 JP6.16
EW115  (via drill 0.38)
  Top 0.254: U6.54 28.01,70.29 v28,70.36
  Bottom 0.254: v28,70.36 28,71.37 26.67,72.64 26.67,75.06 JP6.13
EW116
  Top 0.254: U6.53 28.81,72.92 JP6.14
EW117  (via drill 0.38)
  Top 0.254: U6.52 29.61,70.63 v29.66,70.36
  Bottom 0.254: v29.66,70.36 29.66,72.71 29.21,73.15 29.21,75.06 JP6.11
EW118
  Top 0.254: U6.51 30.41,73.72 JP6.12
EW119  (via drill 0.38)
  Top 0.254: U6.50 31.21,70.39 v31.18,70.36
  Bottom 0.254: v31.18,70.36 31.18,72.58 31.75,73.15 31.75,75.06 JP6.9
EW120
  Top 0.254: U6.49 32.01,72.78 JP6.10
EW121  (via drill 0.38)
  Top 0.254: U6.48 32.81,70.31 v32.77,70.36
  Bottom 0.254: v32.77,70.36 32.77,71.63 34.29,73.15 34.29,75.06 JP6.7
EW122
  Top 0.254: U6.47 33.61,71.84 JP6.8
EW123  (via drill 0.38)
  Top 0.254: U6.46 34.41,70.42 v34.42,70.36
  Bottom 0.254: v34.42,70.36 34.42,71.5 35.31,72.39 36.32,72.39 36.83,72.9 36.83,75.06 JP6.5
EW124
  Top 0.254: U6.45 35.21,72.04 35.56,72.39 36.7,72.39 JP6.6
EW125  (via drill 0.38)
  Top 0.254: U6.44 v36.01,70.35 v36,70.36
  Bottom 0.254: v36,70.36 36,70.55 37.08,71.88 38.35,71.88 39.37,72.9 39.37,75.06 JP6.3
EW126
  Top 0.254: U6.43 36.81,71.35 37.34,71.88 38.73,71.88 JP6.4
EW127  (via drill 0.38)
  Top 0.254: U6.42 37.61,70.25 v37.66,70.36
  Bottom 0.254: v37.66,70.36 37.66,70.42 38.1,70.87 39.62,70.87 41.91,73.15 41.91,75.06 JP6.1
EW128
  Top 0.254: JP6.2 38.47,69.08 U6.41
GND  (via drill 0.64)
  Top 0.254: C8.2 45.97,28.7 | 43.32,60.98 43.32,61.87 | LED1.C 53.58,69.86 58.42,65.02 73.91,65.02 v74.29,64.64
  Top 0.508: U1.6 72.14,33.78 72.9,34.54 | 72.9,34.54 77.49,34.54 | LED2.C 70.6,17.51 70.36,17.27 66.29,17.27 64.77,18.8 TP7.TP | U1.4 64.52,32.51 63.75,31.75 63.75,30.99 64.26,30.48 71.12,30.48 | 71.12,30.48 77.72,30.48 77.98,30.48 | R1.1 77.49,32.49 77.72,32.26 | 53.59,70.09 LED1.C | C7.2 45.85,68.71 | 47.24,52.83 v47.5,53.09 | v62.61,50.04 R3.1 | 42.93,60.98 43.32,60.98 C10.2 42.99,61.78 U6.34 | 42.93,60.98 42.13,60.18 U6.32 | 43.32,61.87 44.2,62.74 47.75,62.74 v48.51,61.98 | 43.38,21.9 43.43,21.84 43.43,21.46 C9.2 | C9.2 42.52,20.3 U5.32 | C9.2 43.56,22.48 44.2,23.11 47.5,23.11 49.02,21.59 v49.02,21.08 | U1.7 72.39,35.05 72.9,34.54 | 80.01,28.45 80.01,26.95 C1.2 | C2.2 70.1,27.94 71.12,28.96 71.12,30.48 | U5.33 43.32,21.1 C9.2 | U5.34 42.99,21.9 C9.2 | U6.33 42.93,60.98
  Top 1.27: R1.1 77.49,34.54 77.49,32.53 C3.2 | C1.2 79.91,19.97 v79.25,19.3 | v79.5,33.27 78.49,32.26 77.72,32.26 77.72,30.48 | v48.51,12.95 C6.2 | 45.85,68.71 v46.99,69.85 | 47.24,52.83 C5.2 45.72,52.32 47.24,50.8 47.24,31.75 v45.97,30.48 45.97,28.7 | C4.- TP6.TP | U2.P$12 67.69,71.25 v74.29,64.64 | 77.98,30.48 80.01,28.45
  Bottom 0.508: 65.02,17.78 64.77,18.29 | 48.51,61.72 v48.51,61.98
  Bottom 1.27: v79.25,19.3 77.72,17.78 65.02,17.78 | v79.5,33.27 79.5,39.62 | 79.5,39.62 TP6.TP | v46.99,69.85 48.01,69.85 48.51,69.34 48.51,61.72 | v47.5,53.09 47.5,54.86 45.21,56.39 45.21,58.42 46.23,59.44 48.01,59.44 48.51,59.94 v48.51,61.98 | v62.61,50.04 64.26,50.04 65.28,49.02 65.28,40.64 66.29,39.62 79.5,39.62 | U2.P$21 72.77,63.12 v74.29,64.64 75.69,66.04 98.04,66.04 102.87,61.47 102.87,58.17 101.6,56.9 85.34,56.9 83.57,55.12 83.57,19.05 75.95,11.43 75.95,5.98 X1.2 | TP4.TP 55.37,6.1 v48.51,12.95 48.51,20.57 v49.02,21.08 49.02,29.72 47.75,30.99 46.48,30.99 v45.97,30.48 51.05,35.56 TP5.TP
  Bottom 2.54: X1.2 X1.3 66.8,4.19 64.77,6.22 | 64.77,6.22 64.77,18.29 TP7.TP | TP4.TP 64.64,6.1 64.77,6.22
LE_L  (via drill 0.38)
  Top 0.254: v57.53,26.16 50.04,26.16 48.51,24.64 42.42,24.64 41.95,25.1 U5.38 | U2.P$7 85.47,60.71 84.2,61.98 52.77,61.98 50.48,64.26 42.67,64.26 41.95,64.98 U6.38
  Bottom 0.254: U2.P$7 81.66,55.63 81.66,28.32 79.5,26.16 v57.53,26.16
N$1
  Top 0.254: U1.5 C3.1
N$2
  Top 0.254: Q1.1 88.65,34.04 82.3,40.39 63.25,40.39 62.61,39.75 62.61,37.21 63.5,36.32 U1.1
N$3
  Top 0.406: 74.42,37.34 74.42,36.8 R1.2
  Top 0.813: U1.8 74.4,36.32 R1.2 | Q1.3 87.5,23.75
  Top 1.27: 87.5,23.75 84.84,26.42 84.84,35.31 81.03,39.12 76.2,39.12 74.42,37.34
N$4
  Top 0.813: 101.98,21.97 102.11,22.1 102.11,25.02 Q1.2 103.12,29.34 103.12,30.61 103.39,30.87 | D1.A 103.63,35.05 103.89,35.31
  Top 2.54: L1.2 101.98,21.97 | 103.39,30.87 D1.A
N$5
  Top 0.254: R4.1 R4.2 66.87,45.91 63.83,45.91 R3.2
N$6
  Top 0.254: U1.3 62.23,33.78 61.34,34.67 61.34,41.66 | R4.3 61.98,44.2 61.34,43.56 61.34,41.66 | R2.1 88.9,35.05 82.3,41.66 61.34,41.66
N$10
  Top 0.254: R5.1 51.88,70.3 LED1.A
N$11
  Top 0.254: R6.1 68.9,18.74 LED2.A
N$12
  Top 0.254: U2.P$4 93.09,60.83 93.98,61.72 101.09,61.72 102.62,60.2 102.62,56.39 TP8.TP
N$13
  Top 0.254: 40.64,25.91 U5.39 42.93,25.9 TP9.TP
N$14
  Top 0.254: U6.39 42.93,65.78 TP10.TP
POL_L  (via drill 0.38)
  Top 0.254: 56.26,51.82 56.26,28.96 58.8,26.42 58.8,20.07 57.4,18.67 40.74,18.67 U5.30 | 56.26,51.82 58.8,53.72 v77.85,53.72 | 56.26,51.82 54.36,51.82 47.59,58.58 U6.30
  Bottom 0.254: v77.85,53.72 78.49,53.72 82.93,58.17 U2.P$8
PP5V0  (via drill 0.38, 0.38 pad 0.64)
  Top 0.254: v56.26,21.97 53.79,19.5 48.51,19.5 46.68,21.34 | v56.26,56.26 51.94,56.26 46.99,61.21 C10.1 | TP2.TP 53.09,75.69 53.85,74.93 53.85,72.96 R5.2 54.1,72.58 54.1,72.39 v57.4,69.09
  Top 0.508: C10.1 44.77,59.62 44.52,59.38 U6.31 | 46.68,21.34 C9.1 44.52,19.5 U5.31
  Bottom 0.254: v56.26,21.97 56.26,26.8 58.8,29.34 58.8,53.72 v56.26,56.26 55.88,56.64 55.88,67.56 v57.4,69.09 58.55,70.23 70.23,70.23 72.77,72.77 U2.P$23
PP12V0  (via drill 0.38, 0.64)
  Top 0.254: TP3.TP 70.87,21.15 R6.2 71.3,21.58 75.07,21.58 74.81,22.35
  Top 0.813: C2.1 64.26,28.19 62.48,29.97 v62.48,32 | v63.63,35.05 U1.2 | 59.94,68.83 v59.94,68.82
  Top 1.27: U2.P$20 65.15,74.04 59.94,68.83 | C2.1 64.77,27.69 66.55,25.91 74.13,25.91 C1.1 74.81,22.35 74.81,14.67 X1.1 72.08,11.94 67.82,11.94 62.48,17.27 62.48,27.18 v61.21,28.45
  Top 2.54: X1.1 85.29,11.99 L1.1
  Bottom 0.813: v62.48,32 62.48,33.91 v63.63,35.05 | v59.94,68.82 59.93,68.82
  Bottom 1.27: 59.93,68.82 57.66,66.55 57.66,58.67 60.07,56.26 60.07,29.59 v61.21,28.45
PP_VAR_VHI  (via drill 0.38, 0.38 pad 0.64)
  Top 0.254: R2.2 D1.C 98.17,35.17 | 100.84,47.5 C4.+ 101.09,47.9 101.09,52.83 97.66,56.26 57.79,56.26 56.52,57.53 v53.72,57.53 | v53.47,28.07 49.21,28.07 47.82,26.67 44.45,26.67 43.05,28.07 C8.1 | v49.4,53.09 47.91,54.58 44.67,54.58 C5.1 | v50.9,14.7 43.91,14.7 42.51,13.3 | v51.28,66.58 44.8,66.58 C7.1 | U5.25 41.11,14.7
  Top 0.508: 41.11,14.7 42.51,13.3 C6.1 | U5.40 41.68,26.7 43.05,28.07 | U6.40 41.3,66.58 C7.1 | U6.25 41.18,54.58 C5.1
  Top 1.27: TP1.TP C4.+
  Top 2.54: 100.84,47.5 98.17,45.09 98.17,35.17
  Bottom 0.254: 54.1,27.43 56.9,30.23 56.9,51.82 55.42,53.59 | v50.9,14.7 53.72,17.14 53.72,27.05 54.1,27.43 | 55.42,53.59 53.72,55.63 v53.72,57.53 53.72,64.26 51.44,66.55 51.31,66.55 v51.28,66.58 | v49.4,53.09 54.91,53.09 55.42,53.59 | 54.1,27.43 v53.47,28.07

### Text on the board
tPlace: 105 | 12V | GND | 5V | GND | 89 | 65 | 41 | 25 | 12V | 1 | Driver Board
bPlace: Stanford Unversity | Ben Wang | Mimi Yang | 3/30/2106